# Altium project CCS_v4.PrjPcb
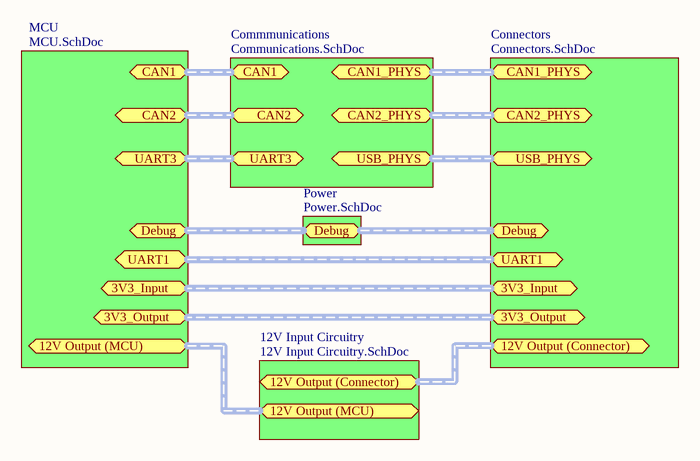
[diagram p0: Main.SchDoc]
6 sheets, 75 parts. Net scope: flat (ports and power ports of the same name join across sheets).
Board file: CCS_V4.0.PcbDoc
Sheets:
  Main.SchDoc
    MCU = MCU.SchDoc
    Connectors = Connectors.SchDoc
    Commmunications = Communications.SchDoc
    Power = Power.SchDoc
    12V Input Circuitry = 12V Input Circuitry.SchDoc

## Sheet Main.SchDoc
size A4

### Sub-sheets
12V Input Circuitry = 12V Input Circuitry.SchDoc: no entries
Commmunications = Communications.SchDoc: no entries
Connectors = Connectors.SchDoc: no entries
MCU = MCU.SchDoc: no entries
Power = Power.SchDoc: no entries

### Ports
3V3_Input (harness IO), 3V3_Output (harness IO), 12V Output (Connector) (harness IO), 12V Output (MCU) (harness IO), CAN1 (harness CAN), CAN1_PHYS (harness CAN_PHYS), CAN2 (harness CAN), CAN2_PHYS (harness CAN_PHYS), Debug (harness Debug), UART1 (harness UART), UART3 (harness UART with Flow Control), USB_PHYS (harness USB_PHYS)

## Sheet MCU.SchDoc
size A4
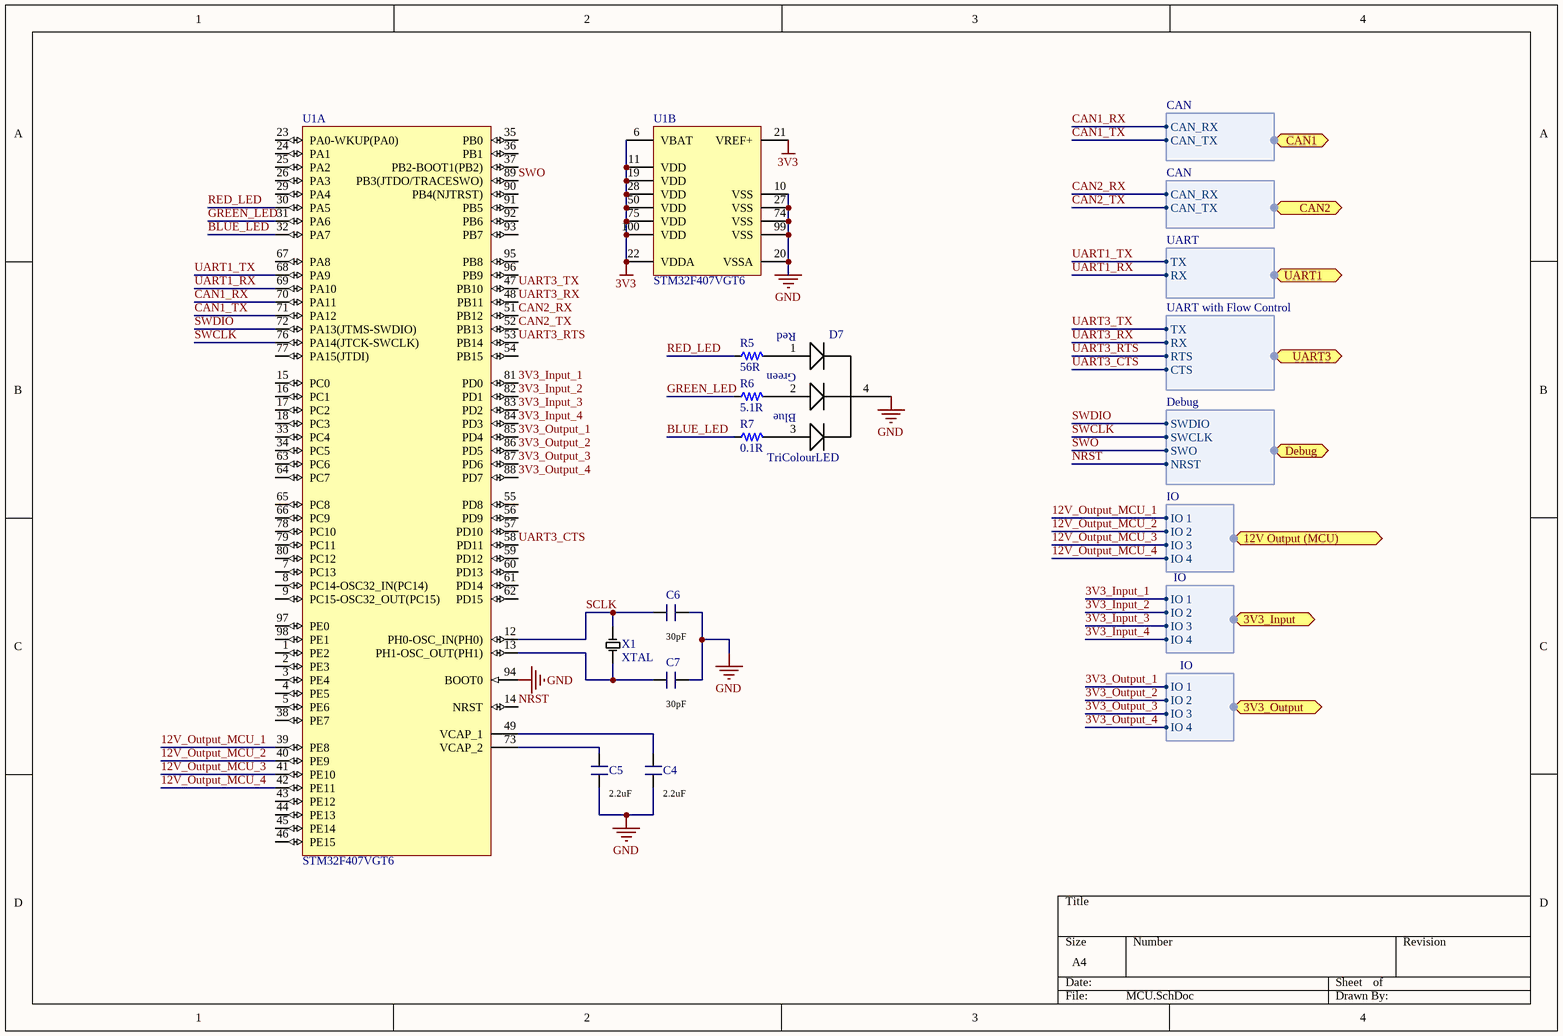
[diagram p1: MCU.SchDoc]

### Parts
C4  Capacitance: 2.2uF  [PCB_GENERIC_SMD_0603]  (hidden comment: SCH_GENERIC_CAPACITOR_0603)
C5  Capacitance: 2.2uF  [PCB_GENERIC_SMD_0603]  (hidden comment: SCH_GENERIC_CAPACITOR_0603)
C6  Capacitance: 30pF  [PCB_GENERIC_SMD_0603]  (hidden comment: SCH_GENERIC_CAPACITOR_0603)
C7  Capacitance: 30pF  [PCB_GENERIC_SMD_0603]  (hidden comment: SCH_GENERIC_CAPACITOR_0603)
D7  TriColourLED  [TricolourLED - SunLED - DK  1497-1225-2-ND]
R5  Resistance: 56R  [PCB_GENERIC_SMD_0603]  (hidden comment: SCH_GENERIC_RESISTOR_0603)
R6  Resistance: 5.1R  [PCB_GENERIC_SMD_0603]  (hidden comment: SCH_GENERIC_RESISTOR_0603)
R7  Resistance: 0.1R  [PCB_GENERIC_SMD_0603]  (hidden comment: SCH_GENERIC_RESISTOR_0603)
U1  STM32F407VGT6  [STM-LQFP100_M]  (parts A,B of 2)
X1  XTAL  [CRYSTAL_8MHZ]

### Ports
3V3_Input (harness IO), 3V3_Output (harness IO), 12V Output (MCU) (harness IO), CAN1 (harness CAN), CAN2 (harness CAN), Debug (harness Debug), UART1 (harness UART), UART3 (harness UART with Flow Control)

### Harnesses
CAN: CAN_RX, CAN_TX
Debug: SWDIO, SWCLK, SWO, NRST
UART with Flow Control: TX, RX, RTS, CTS
UART: TX, RX
IO: IO 1, IO 2, IO 3, IO 4

### Nets
3V3: U1.6(VBAT) U1.11(VDD) U1.19(VDD) U1.21(VREF+) U1.22(VDDA) U1.28(VDD) U1.50(VDD) U1.75(VDD) U1.100(VDD)
GND: C4.1 C5.1 C6.1 C7.1 D7.4 U1.10(VSS) U1.20(VSSA) U1.27(VSS) U1.74(VSS) U1.94(BOOT0) U1.99(VSS)
3V3_Input_1: U1.81(PD0) ; port 3V3_Input.IO 1
3V3_Input_2: U1.82(PD1) ; port 3V3_Input.IO 2
3V3_Input_3: U1.83(PD2) ; port 3V3_Input.IO 3
3V3_Input_4: U1.84(PD3) ; port 3V3_Input.IO 4
3V3_Output_1: U1.85(PD4) ; port 3V3_Output.IO 1
3V3_Output_2: U1.86(PD5) ; port 3V3_Output.IO 2
3V3_Output_3: U1.87(PD6) ; port 3V3_Output.IO 3
3V3_Output_4: U1.88(PD7) ; port 3V3_Output.IO 4
12V_Output_MCU_1: U1.39(PE8) ; port 12V Output (MCU).IO 1
12V_Output_MCU_2: U1.40(PE9) ; port 12V Output (MCU).IO 2
12V_Output_MCU_3: U1.41(PE10) ; port 12V Output (MCU).IO 3
12V_Output_MCU_4: U1.42(PE11) ; port 12V Output (MCU).IO 4
BLUE_LED: R7.1 U1.32(PA7)
CAN1_RX: U1.70(PA11) ; port CAN1.CAN_RX
CAN1_TX: U1.71(PA12) ; port CAN1.CAN_TX
CAN2_RX: U1.51(PB12) ; port CAN2.CAN_RX
CAN2_TX: U1.52(PB13) ; port CAN2.CAN_TX
GREEN_LED: R6.1 U1.31(PA6)
NRST: U1.14(NRST) ; port Debug.NRST
RED_LED: R5.1 U1.30(PA5)
SCLK: C6.2 U1.12(PH0-OSC_IN(PH0)) X1.1
SWCLK: U1.76(PA14(JTCK-SWCLK)) ; port Debug.SWCLK
SWDIO: U1.72(PA13(JTMS-SWDIO)) ; port Debug.SWDIO
SWO: U1.89(PB3(JTDO/TRACESWO)) ; port Debug.SWO
UART1_RX: U1.69(PA10) ; port UART1.RX
UART1_TX: U1.68(PA9) ; port UART1.TX
UART3_CTS: U1.58(PD11) ; port UART3.CTS
UART3_RTS: U1.53(PB14) ; port UART3.RTS
UART3_RX: U1.48(PB11) ; port UART3.RX
UART3_TX: U1.47(PB10) ; port UART3.TX
NetC4_2: C4.2 U1.49(VCAP_1)
NetC5_2: C5.2 U1.73(VCAP_2)
NetC7_2: C7.2 U1.13(PH1-OSC_OUT(PH1)) X1.2
NetD7_1: D7.1(Red) R5.2
NetD7_2: D7.2(Green) R6.2
NetD7_3: D7.3(Blue) R7.2

Not connected (* = marked no-connect by the designer): U1 1(PE2) 2(PE3) 3(PE4) 4(PE5) 5(PE6) 7(PC13) 8(PC14-OSC32_IN(PC14)) 9(PC15-OSC32_OUT(PC15)) 15(PC0) 16(PC1) 17(PC2) 18(PC3) 23(PA0-WKUP(PA0)) 24(PA1) 25(PA2) 26(PA3) 29(PA4) 33(PC4) 34(PC5) 35(PB0) 36(PB1) 37(PB2-BOOT1(PB2)) 38(PE7) 43(PE12) 44(PE13) 45(PE14) 46(PE15) 54(PB15) 55(PD8) 56(PD9) 57(PD10) 59(PD12) 60(PD13) 61(PD14) 62(PD15) 63(PC6) 64(PC7) 65(PC8) 66(PC9) 67(PA8) 77(PA15(JTDI)) 78(PC10) 79(PC11) 80(PC12) 90(PB4(NJTRST)) 91(PB5) 92(PB6) 93(PB7) 95(PB8) 96(PB9) 97(PE0) 98(PE1)

### Library data of the parts
C4-C7 = SCH_GENERIC_CAPACITOR_0603: Generic SMD capacitor 0603; Tolerance: *%
R5-R7 = SCH_GENERIC_RESISTOR_0603: Generic SMD resistor 0603
U1 = STM32F407VGT6: ARM Cortex-M4 32-bit MCU+FPU, 210 DMIPS, 1024 kB Flash, 192 kB Internal RAM, 82 I/Os, 100-pin LQFP, -40 to 85 degC, Tray; Manufacturer: STMicroelectronics; D/A Converter: 2x12-bit; FLASH Size (Prog) (kB): 1024; I/Os (High Current): 82; Internal RAM Size (kB): 192; Operating Frequency(F) (Processor speed) (MHz): 168; Supply Voltage(Vcc) max (V): 3.6; Supply Voltage(Vcc) min (V): 1.8; DatasheetVersion: Rev. 4; PackageVersion: Rev. 1, 06/2013; PackageReference: LQFP100; PackageDescription: 100-Pin Low Profile Quad Flat Package, 14 x 14 mm Body, 0.5 mm Pitch; Supplier 1: Digi-Key; Supplier Part Number 1: 497-11605-ND; Supplier 2: Farnell; Supplier Part Number 2: 2064368; Supplier 3: Newark; Supplier Part Number 3: 73T2333; Supplier 4: Mouser; Supplier Part Number 4: 511-STM32F407VGT6; Core: ARM Cortex-M4; Packing: Tray; Mounting Technology: Surface Mount; PartNumber: STM32F407VGT6; ComponentLink1Description: Manufacturer URL; ComponentLink1URL: http://www.st.com/web/en/home.html; ComponentLink2Description: Datasheet; ComponentLink2URL: http://www.st.com/st-web-ui/static/active/en/resource/technical/document/datasheet/DM00037051.pdf; ComponentLink3Description: Package Specification; ComponentLink3URL: http://www.st.com/st-web-ui/static/active/en/resource/technical/document/data_brief/DM00071938.pdf
X1 = Crystal: Frequency: 8MHz

## Sheet Connectors.SchDoc
size A4
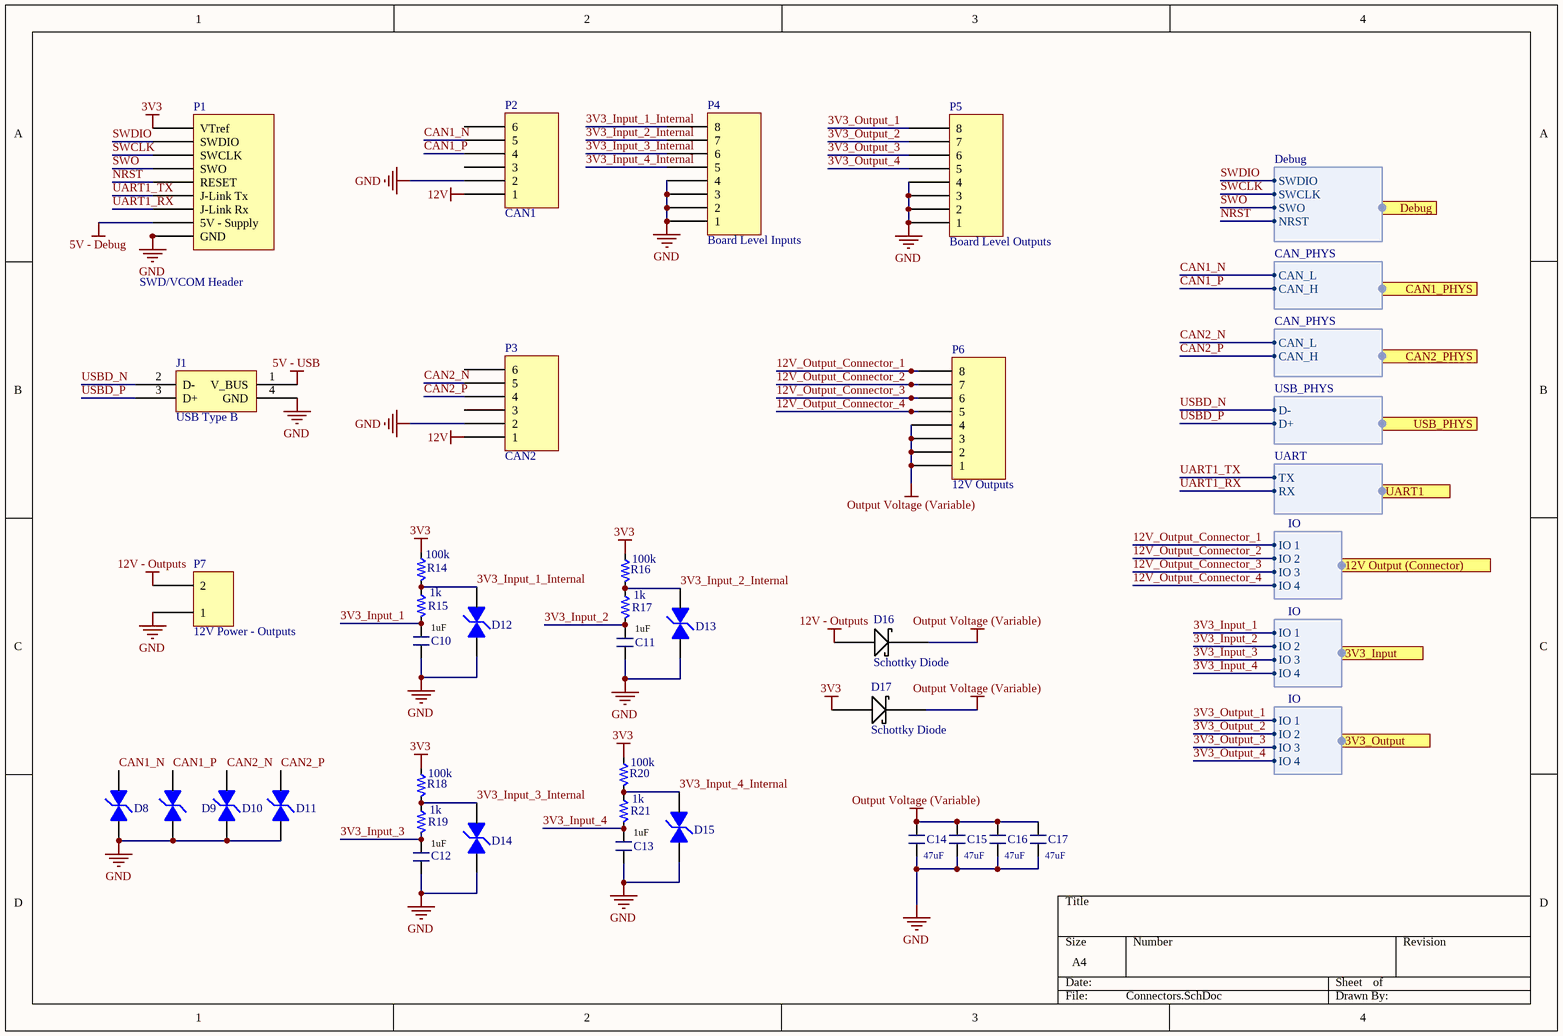
[diagram p2: Connectors.SchDoc]

### Parts
C10  Capacitance: 1uF  [PCB_GENERIC_SMD_0603]  (hidden comment: SCH_GENERIC_CAPACITOR_0603)
C11  Capacitance: 1uF  [PCB_GENERIC_SMD_0603]  (hidden comment: SCH_GENERIC_CAPACITOR_0603)
C12  Capacitance: 1uF  [PCB_GENERIC_SMD_0603]  (hidden comment: SCH_GENERIC_CAPACITOR_0603)
C13  Capacitance: 1uF  [PCB_GENERIC_SMD_0603]  (hidden comment: SCH_GENERIC_CAPACITOR_0603)
C14  Capacitance: 47uF  [PCB_GENERIC_CAPACITOR_1210]  (hidden comment: SCH_GENERIC_CAPACITOR_1210)
C15  Capacitance: 47uF  [PCB_GENERIC_CAPACITOR_1210]  (hidden comment: SCH_GENERIC_CAPACITOR_1210)
C16  Capacitance: 47uF  [PCB_GENERIC_CAPACITOR_1210]  (hidden comment: SCH_GENERIC_CAPACITOR_1210)
C17  Capacitance: 47uF  [PCB_GENERIC_CAPACITOR_1210]  (hidden comment: SCH_GENERIC_CAPACITOR_1210)
D8  TVS Diode  [TVS Diode]  (value not drawn)
D9  TVS Diode  [TVS Diode]  (value not drawn)
D10  TVS Diode  [TVS Diode]  (value not drawn)
D11  TVS Diode  [TVS Diode]  (value not drawn)
D12  TVS Diode  [TVS Diode]  (value not drawn)
D13  TVS Diode  [TVS Diode]  (value not drawn)
D14  TVS Diode  [TVS Diode]  (value not drawn)
D15  TVS Diode  [TVS Diode]  (value not drawn)
D16  Schottky Diode  [ON Semi Schottky Diode - MBRM110LT1G]
D17  Schottky Diode  [ON Semi Schottky Diode - MBRM110LT1G]
J1  USB Type B  [0670688000]
P1  SWD/VCOM Header  [Samtec TST-110-01-G-D]
P2  CAN1  [PCB_MLX_MICROFIT_3X2]
P3  CAN2  [PCB_MLX_MICROFIT_3X2]
P4  Board Level Inputs  [PCB_MLX_MICROFIT_4X2]
P5  Board Level Outputs  [PCB_MLX_MICROFIT_4X2]
P6  12V Outputs  [PCB_MLX_MICROFIT_4X2]
P7  12V Power - Outputs  [Molex Mini-Fit Jr 2x1]
R14  Resistance: 100k  [PCB_GENERIC_SMD_0603]  (hidden comment: SCH_GENERIC_RESISTOR_0603)
R15  Resistance: 1k  [PCB_GENERIC_SMD_0603]  (hidden comment: SCH_GENERIC_RESISTOR_0603)
R16  Resistance: 100k  [PCB_GENERIC_SMD_0603]  (hidden comment: SCH_GENERIC_RESISTOR_0603)
R17  Resistance: 1k  [PCB_GENERIC_SMD_0603]  (hidden comment: SCH_GENERIC_RESISTOR_0603)
R18  Resistance: 100k  [PCB_GENERIC_SMD_0603]  (hidden comment: SCH_GENERIC_RESISTOR_0603)
R19  Resistance: 1k  [PCB_GENERIC_SMD_0603]  (hidden comment: SCH_GENERIC_RESISTOR_0603)
R20  Resistance: 100k  [PCB_GENERIC_SMD_0603]  (hidden comment: SCH_GENERIC_RESISTOR_0603)
R21  Resistance: 1k  [PCB_GENERIC_SMD_0603]  (hidden comment: SCH_GENERIC_RESISTOR_0603)

### Ports
3V3_Input (harness IO), 3V3_Output (harness IO), 12V Output (Connector) (harness IO), CAN1_PHYS (harness CAN_PHYS), CAN2_PHYS (harness CAN_PHYS), Debug (harness Debug), UART1 (harness UART), USB_PHYS (harness USB_PHYS)

### Harnesses
Debug: SWDIO, SWCLK, SWO, NRST
CAN_PHYS: CAN_L, CAN_H
USB_PHYS: D-, D+
UART: TX, RX
IO: IO 1, IO 2, IO 3, IO 4

### Nets
3V3: D17.2 P1.1(VTref) R14.1 R16.1 R18.1 R20.1
5V - Debug: P1.19(5V_-_Supply)
5V - USB: J1.1(V_BUS)
12V: P2.1 P3.1
12V - Outputs: D16.2 P7.2
GND: C10.1 C11.1 C12.1 C13.1 C14.1 C15.1 C16.1 C17.1 D8.2 D9.2 D10.2 D11.2 D12.2 D13.2 D14.2 D15.2 J1.4(GND) P1.4(GND) P1.6(GND) P1.8(GND) P1.10(GND) P1.12(GND) P2.2 P3.2 P4.1 P4.2 P4.3 P4.4 P5.1 P5.2 P5.3 P5.4 P7.1
Output Voltage (Variable): C14.2 C15.2 C16.2 C17.2 D16.1 D17.1 P6.1 P6.2 P6.3 P6.4
3V3_Input_1: C10.2 R15.2 ; port 3V3_Input.IO 1
3V3_Input_1_Internal: D12.1 P4.8 R14.2 R15.1
3V3_Input_2: C11.2 R17.2 ; port 3V3_Input.IO 2
3V3_Input_2_Internal: D13.1 P4.7 R16.2 R17.1
3V3_Input_3: C12.2 R19.2 ; port 3V3_Input.IO 3
3V3_Input_3_Internal: D14.1 P4.6 R18.2 R19.1
3V3_Input_4: C13.2 R21.2 ; port 3V3_Input.IO 4
3V3_Input_4_Internal: D15.1 P4.5 R20.2 R21.1
3V3_Output_1: P5.8 ; port 3V3_Output.IO 1
3V3_Output_2: P5.7 ; port 3V3_Output.IO 2
3V3_Output_3: P5.6 ; port 3V3_Output.IO 3
3V3_Output_4: P5.5 ; port 3V3_Output.IO 4
12V_Output_Connector_1: P6.8 ; port 12V Output (Connector).IO 1
12V_Output_Connector_2: P6.7 ; port 12V Output (Connector).IO 2
12V_Output_Connector_3: P6.6 ; port 12V Output (Connector).IO 3
12V_Output_Connector_4: P6.5 ; port 12V Output (Connector).IO 4
CAN1_N: D8.1 P2.5 ; port CAN1_PHYS.CAN_L
CAN1_P: D9.1 P2.4 ; port CAN1_PHYS.CAN_H
CAN2_N: D10.1 P3.5 ; port CAN2_PHYS.CAN_L
CAN2_P: D11.1 P3.4 ; port CAN2_PHYS.CAN_H
NRST: P1.15(RESET) ; port Debug.NRST
SWCLK: P1.9(SWCLK) ; port Debug.SWCLK
SWDIO: P1.7(SWDIO) ; port Debug.SWDIO
SWO: P1.13(SWO) ; port Debug.SWO
UART1_RX: P1.17(J-Link_Rx) ; port UART1.RX
UART1_TX: P1.5(J-Link_Tx) ; port UART1.TX
USBD_N: J1.2(D-) ; port USB_PHYS.D-
USBD_P: J1.3(D+) ; port USB_PHYS.D+

Not connected (* = marked no-connect by the designer): P2 3 6; P3 3 6

### Library data of the parts
C10-C13 = SCH_GENERIC_CAPACITOR_0603: as C4 on sheet MCU
C14-C17 = SCH_GENERIC_CAPACITOR_1210: Generic SMD capacitor 1210
D8-D15 = TVS Diode: Manufacturer: Bourns; Manufacturer ID: CDSOD323-T03SC
D16 D17 = ON Semi Schottky Diode - MBRM110LT1G
J1 = 0670688000
P2 P3 = SCH_MLX_MICROFIT_3X2
P4-P6 = SCH_MLX_MICROFIT_4X2: Molex Microfit Connector 4x2
P7 = Molex Mini-Fit 1x2
R14-R21 = SCH_GENERIC_RESISTOR_0603: Generic SMD resistor 0603

## Sheet Communications.SchDoc
size A4
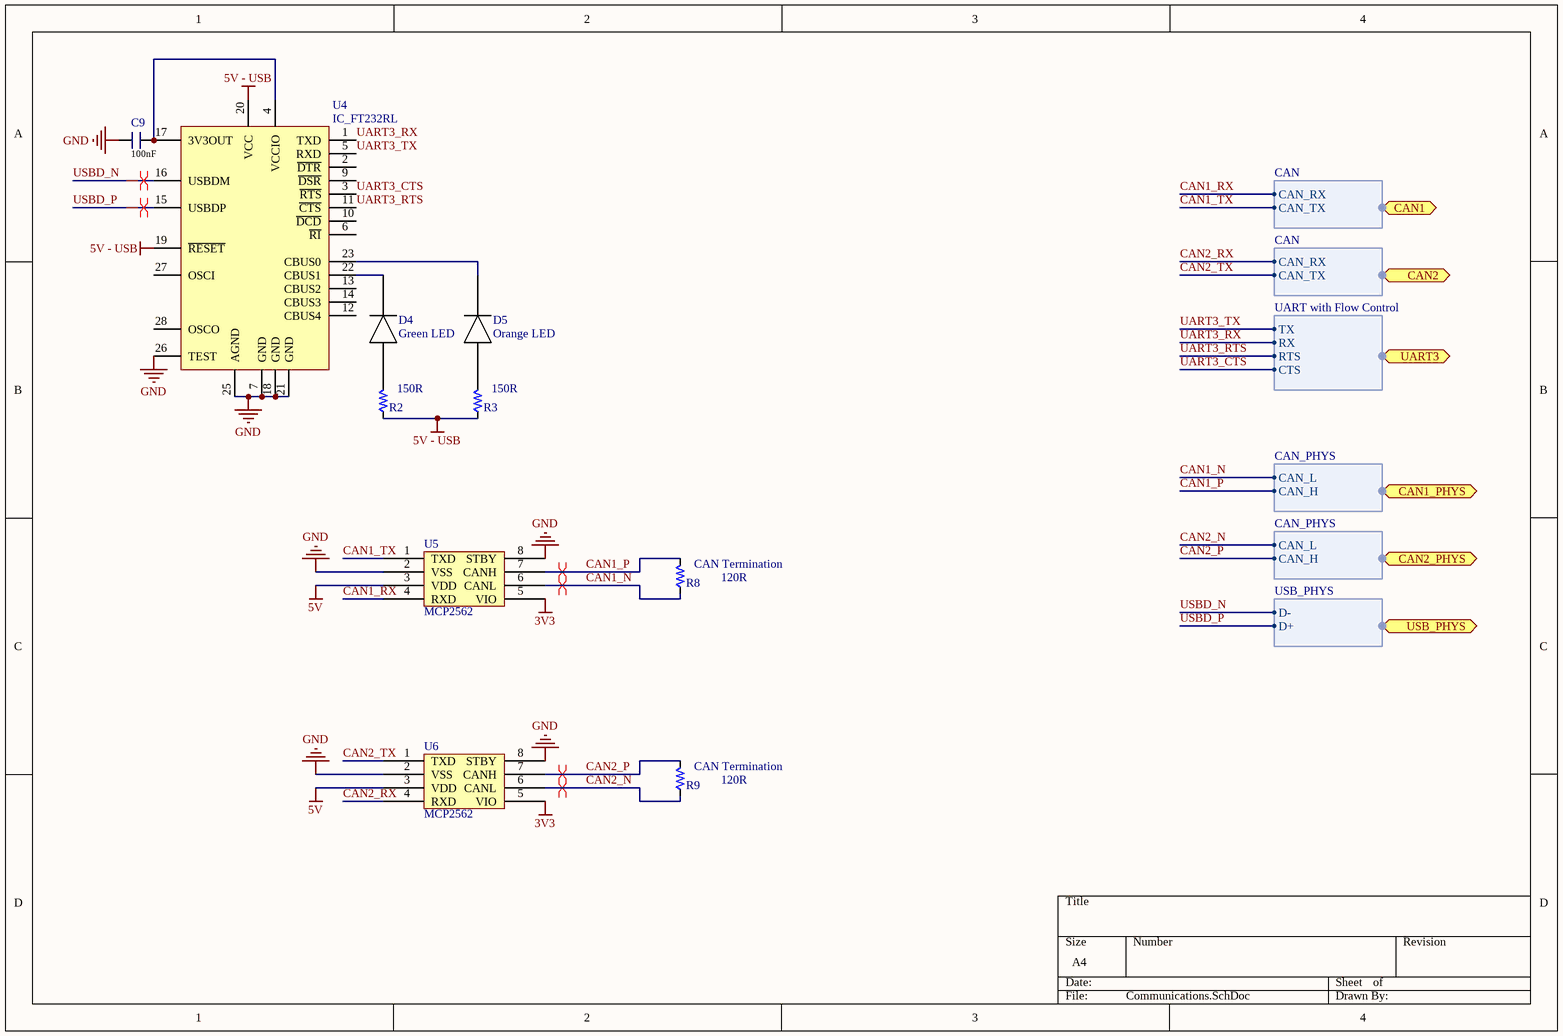
[diagram p3: Communications.SchDoc]

### Parts
C9  Capacitance: 100nF  [PCB_GENERIC_SMD_0603]  (hidden comment: SCH_GENERIC_CAPACITOR_0603)
D4  Green LED  [SMD_0603_LED]
D5  Orange LED  [SMD_0603_LED]
R2  Resistance: 150R  [PCB_GENERIC_SMD_0603]  (hidden comment: SCH_GENERIC_RESISTOR_0603)
R3  Resistance: 150R  [PCB_GENERIC_SMD_0603]  (hidden comment: SCH_GENERIC_RESISTOR_0603)
R8  CAN Termination  Resistance: 120R  [PCB_GENERIC_SMD_0603]
R9  CAN Termination  Resistance: 120R  [PCB_GENERIC_SMD_0603]
U4  IC_FT232RL  [SSOP-28]
U5  MCP2562  [MCP2562]
U6  MCP2562  [MCP2562]

### Ports
CAN1 (harness CAN), CAN1_PHYS (harness CAN_PHYS), CAN2 (harness CAN), CAN2_PHYS (harness CAN_PHYS), UART3 (harness UART with Flow Control), USB_PHYS (harness USB_PHYS)

### Harnesses
CAN_PHYS: CAN_L, CAN_H
CAN: CAN_RX, CAN_TX
UART with Flow Control: TX, RX, RTS, CTS
USB_PHYS: D-, D+

### Nets
3V3: U5.5(VIO) U6.5(VIO)
5V: U5.3(VDD) U6.3(VDD)
5V - USB: R2.1 R3.1 U4.19(~{RESET}) U4.20(VCC)
GND: C9.2 U4.7(GND) U4.18(GND) U4.21(GND) U4.25(AGND) U4.26(TEST) U5.2(VSS) U5.8(STBY) U6.2(VSS) U6.8(STBY)
NC: U4.8(NC) U4.24(NC)
CAN1_N: R8.1 U5.6(CANL) ; port CAN1_PHYS.CAN_L
CAN1_P: R8.2 U5.7(CANH) ; port CAN1_PHYS.CAN_H
CAN1_RX: U5.4(RXD) ; port CAN1.CAN_RX
CAN1_TX: U5.1(TXD) ; port CAN1.CAN_TX
CAN2_N: R9.1 U6.6(CANL) ; port CAN2_PHYS.CAN_L
CAN2_P: R9.2 U6.7(CANH) ; port CAN2_PHYS.CAN_H
CAN2_RX: U6.4(RXD) ; port CAN2.CAN_RX
CAN2_TX: U6.1(TXD) ; port CAN2.CAN_TX
UART3_CTS: U4.3(~{RTS}) ; port UART3.CTS
UART3_RTS: U4.11(~{CTS}) ; port UART3.RTS
UART3_RX: U4.1(TXD) ; port UART3.RX
UART3_TX: U4.5(RXD) ; port UART3.TX
USBD_N: U4.16(USBDM) ; port USB_PHYS.D-
USBD_P: U4.15(USBDP) ; port USB_PHYS.D+
NetC9_1: C9.1 U4.4(VCCIO) U4.17(3V3OUT)
NetD4_1: D4.1 R2.2
NetD4_2: D4.2 U4.22(CBUS1)
NetD5_1: D5.1 R3.2
NetD5_2: D5.2 U4.23(CBUS0)

Not connected (* = marked no-connect by the designer): U4 2(~{DTR}) 6(~{RI}) 9(~{DSR}) 10(~{DCD}) 12(CBUS4) 13(CBUS2) 14(CBUS3) 27(OSCI) 28(OSCO)

### Layout directives
differential pair: CAN1_N, CAN1_P, CAN2_N, CAN2_P, USBD_N, USBD_P

### Library data of the parts
C9 = SCH_GENERIC_CAPACITOR_0603: as C4 on sheet MCU
D4 D5 = SMD_0603_LED
R2 R3 R8 R9 = SCH_GENERIC_RESISTOR_0603: Generic SMD resistor 0603
U4 = IC_FT232RL: FT232R USB UART; Manufacturer: *; Note: *; ManufacturerPartNo: *

## Sheet Power.SchDoc
size A4
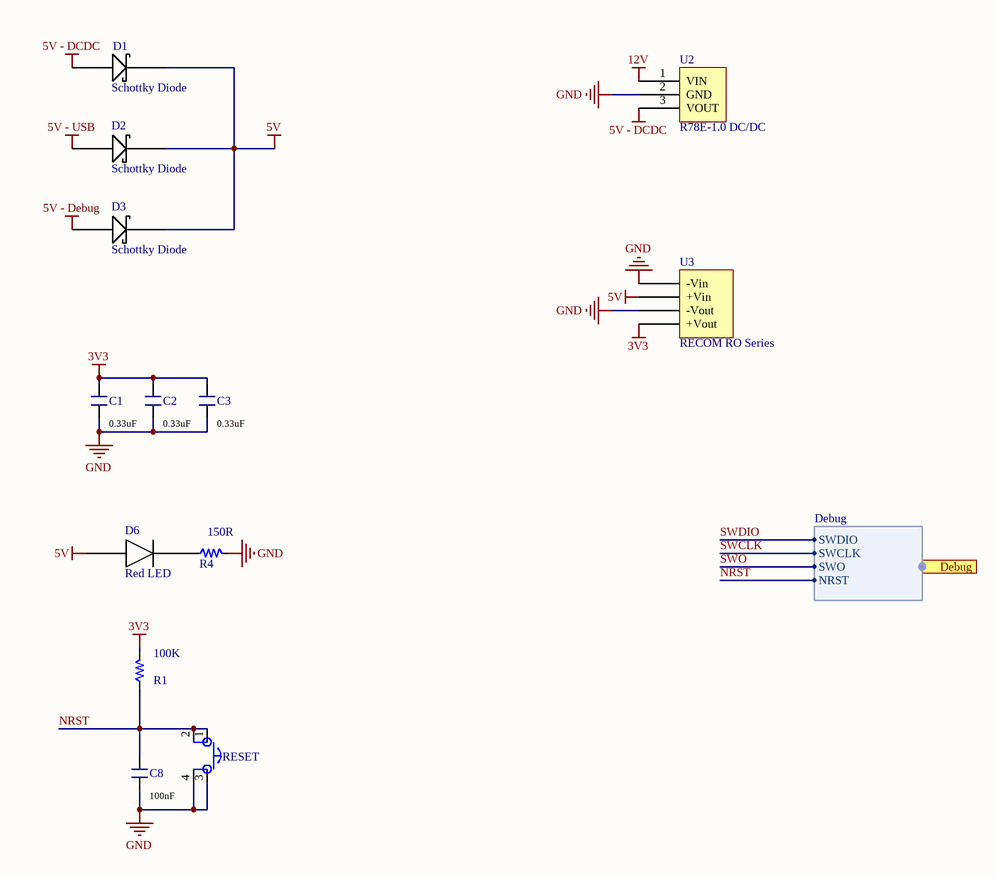
[diagram p4: Power.SchDoc]

### Parts
C1  Capacitance: 0.33uF  [PCB_GENERIC_SMD_0603]  (hidden comment: SCH_GENERIC_CAPACITOR_0603)
C2  Capacitance: 0.33uF  [PCB_GENERIC_SMD_0603]  (hidden comment: SCH_GENERIC_CAPACITOR_0603)
C3  Capacitance: 0.33uF  [PCB_GENERIC_SMD_0603]  (hidden comment: SCH_GENERIC_CAPACITOR_0603)
C8  Capacitance: 100nF  [PCB_GENERIC_SMD_0603]  (hidden comment: SCH_GENERIC_CAPACITOR_0603)
D1  Schottky Diode  [ON Semi Schottky Diode - MBRM110LT1G]
D2  Schottky Diode  [ON Semi Schottky Diode - MBRM110LT1G]
D3  Schottky Diode  [ON Semi Schottky Diode - MBRM110LT1G]
D6  Red LED  [SMD_0603_LED]
R1  Resistance: 100K  [PCB_GENERIC_SMD_0603]  (hidden comment: SCH_GENERIC_RESISTOR_0603)
R4  Resistance: 150R  [PCB_GENERIC_SMD_0603]  (hidden comment: SCH_GENERIC_RESISTOR_0603)
RESET  Tactile Switch  [C&K 4 pin Tactile Switch]  (value not drawn)
U2  R78E-1.0 DC/DC  [R78-1.0]
U3  RECOM RO Series  [RECOM RO Series 1W DCDC]

### Ports
Debug (harness Debug)

### Harnesses
Debug: SWDIO, SWCLK, SWO, NRST

### Nets
3V3: C1.2 C2.2 C3.2 R1.2 U3.4(+Vout)
5V: D1.1 D2.1 D3.1 D6.1 U3.2(+Vin)
5V - DCDC: D1.2 U2.3(VOUT)
5V - Debug: D3.2
5V - USB: D2.2
12V: U2.1(VIN)
GND: C1.1 C2.1 C3.1 C8.2 R4.2 RESET.3 RESET.4 U2.2(GND) U3.1(-Vin) U3.3(-Vout)
NRST: C8.1 R1.1 RESET.1 RESET.2 ; port Debug.NRST
NetD6_2: D6.2 R4.1

### Library data of the parts
C1 = SCH_GENERIC_CAPACITOR_0603: Generic SMD capacitor 0603
C2 C3 C8 = SCH_GENERIC_CAPACITOR_0603: as C4 on sheet MCU
D1-D3 = ON Semi Schottky Diode - MBRM110LT1G
D6 = SMD_0603_LED
R1 R4 = SCH_GENERIC_RESISTOR_0603: Generic SMD resistor 0603
RESET = C&K Tactile Switch: Supplier 1: Digi-Key; Supplier Part Number 1: CKN9085CT-ND
U2 = R78E-1.0
U3 = RECOM RO Series DCDC Converter

## Sheet 12V Input Circuitry.SchDoc
size A4
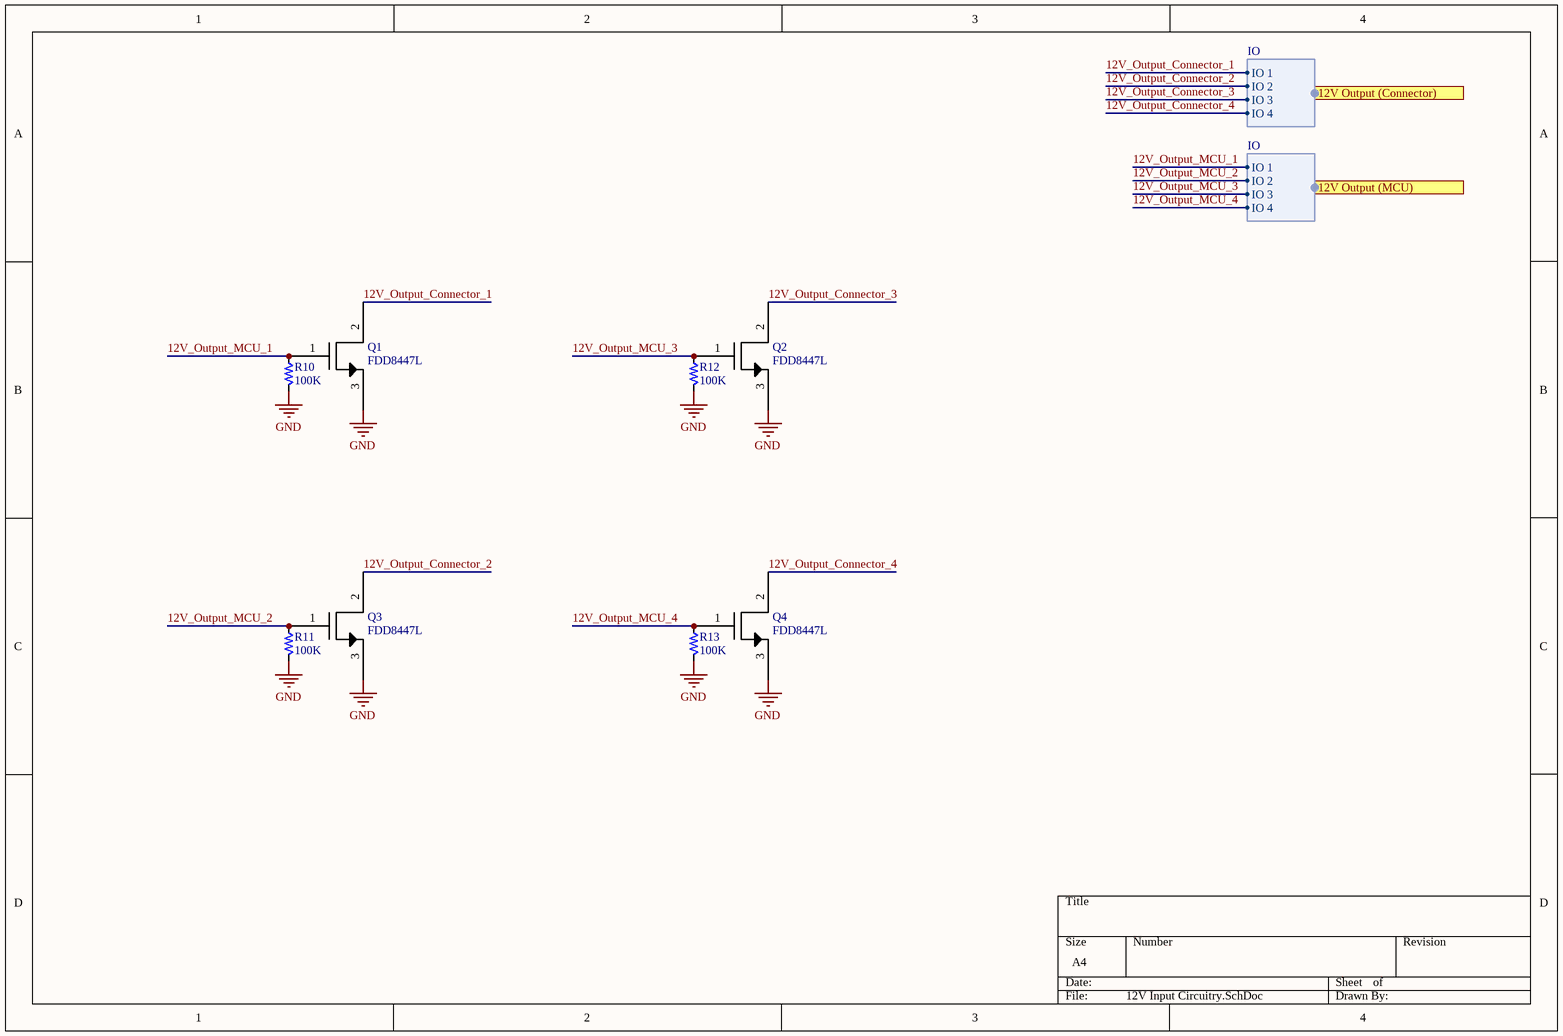
[diagram p5: 12V Input Circuitry.SchDoc]

### Parts
Q1  FDD8447L  [FDD8447L]
Q2  FDD8447L  [FDD8447L]
Q3  FDD8447L  [FDD8447L]
Q4  FDD8447L  [FDD8447L]
R10  Resistance: 100K  [PCB_GENERIC_SMD_0603]  (hidden comment: SCH_GENERIC_RESISTOR_0603)
R11  Resistance: 100K  [PCB_GENERIC_SMD_0603]  (hidden comment: SCH_GENERIC_RESISTOR_0603)
R12  Resistance: 100K  [PCB_GENERIC_SMD_0603]  (hidden comment: SCH_GENERIC_RESISTOR_0603)
R13  Resistance: 100K  [PCB_GENERIC_SMD_0603]  (hidden comment: SCH_GENERIC_RESISTOR_0603)

### Ports
12V Output (Connector) (harness IO), 12V Output (MCU) (harness IO)

### Harnesses
IO: IO 1, IO 2, IO 3, IO 4

### Nets
GND: Q1.3 Q2.3 Q3.3 Q4.3 R10.2 R11.2 R12.2 R13.2
12V_Output_Connector_1: Q1.2 ; port 12V Output (Connector).IO 1
12V_Output_Connector_2: Q3.2 ; port 12V Output (Connector).IO 2
12V_Output_Connector_3: Q2.2 ; port 12V Output (Connector).IO 3
12V_Output_Connector_4: Q4.2 ; port 12V Output (Connector).IO 4
12V_Output_MCU_1: Q1.1 R10.1 ; port 12V Output (MCU).IO 1
12V_Output_MCU_2: Q3.1 R11.1 ; port 12V Output (MCU).IO 2
12V_Output_MCU_3: Q2.1 R12.1 ; port 12V Output (MCU).IO 3
12V_Output_MCU_4: Q4.1 R13.1 ; port 12V Output (MCU).IO 4

### Library data of the parts
Q1-Q4 = NMOS
R10-R13 = SCH_GENERIC_RESISTOR_0603: Generic SMD resistor 0603

## Nets that join several sheets
3V3: MCU (9 pins), Connectors (6 pins), Communications (U5.5 U6.5), Power (5 pins)
5V: Communications (U5.3 U6.3), Power (5 pins)
5V - Debug: Connectors (P1.19), Power (D3.2)
5V - USB: Connectors (J1.1), Communications (R2.1 R3.1 U4.19 U4.20), Power (D2.2)
12V: Connectors (P2.1 P3.1), Power (U2.1)
GND: MCU (11 pins), Connectors (33 pins), Communications (10 pins), Power (10 pins), 12V Input Circuitry (8 pins)
3V3_Input_1: MCU (U1.81), Connectors (C10.2 R15.2)
3V3_Input_2: MCU (U1.82), Connectors (C11.2 R17.2)
3V3_Input_3: MCU (U1.83), Connectors (C12.2 R19.2)
3V3_Input_4: MCU (U1.84), Connectors (C13.2 R21.2)
3V3_Output_1: MCU (U1.85), Connectors (P5.8)
3V3_Output_2: MCU (U1.86), Connectors (P5.7)
3V3_Output_3: MCU (U1.87), Connectors (P5.6)
3V3_Output_4: MCU (U1.88), Connectors (P5.5)
12V_Output_Connector_1: Connectors (P6.8), 12V Input Circuitry (Q1.2)
12V_Output_Connector_2: Connectors (P6.7), 12V Input Circuitry (Q3.2)
12V_Output_Connector_3: Connectors (P6.6), 12V Input Circuitry (Q2.2)
12V_Output_Connector_4: Connectors (P6.5), 12V Input Circuitry (Q4.2)
12V_Output_MCU_1: MCU (U1.39), 12V Input Circuitry (Q1.1 R10.1)
12V_Output_MCU_2: MCU (U1.40), 12V Input Circuitry (Q3.1 R11.1)
12V_Output_MCU_3: MCU (U1.41), 12V Input Circuitry (Q2.1 R12.1)
12V_Output_MCU_4: MCU (U1.42), 12V Input Circuitry (Q4.1 R13.1)
CAN1_N: Connectors (D8.1 P2.5), Communications (R8.1 U5.6)
CAN1_P: Connectors (D9.1 P2.4), Communications (R8.2 U5.7)
CAN1_RX: MCU (U1.70), Communications (U5.4)
CAN1_TX: MCU (U1.71), Communications (U5.1)
CAN2_N: Connectors (D10.1 P3.5), Communications (R9.1 U6.6)
CAN2_P: Connectors (D11.1 P3.4), Communications (R9.2 U6.7)
CAN2_RX: MCU (U1.51), Communications (U6.4)
CAN2_TX: MCU (U1.52), Communications (U6.1)
NRST: MCU (U1.14), Connectors (P1.15), Power (C8.1 R1.1 RESET.1 RESET.2)
SWCLK: MCU (U1.76), Connectors (P1.9)
SWDIO: MCU (U1.72), Connectors (P1.7)
SWO: MCU (U1.89), Connectors (P1.13)
UART1_RX: MCU (U1.69), Connectors (P1.17)
UART1_TX: MCU (U1.68), Connectors (P1.5)
UART3_CTS: MCU (U1.58), Communications (U4.3)
UART3_RTS: MCU (U1.53), Communications (U4.11)
UART3_RX: MCU (U1.48), Communications (U4.1)
UART3_TX: MCU (U1.47), Communications (U4.5)
USBD_N: Connectors (J1.2), Communications (U4.16)
USBD_P: Connectors (J1.3), Communications (U4.15)